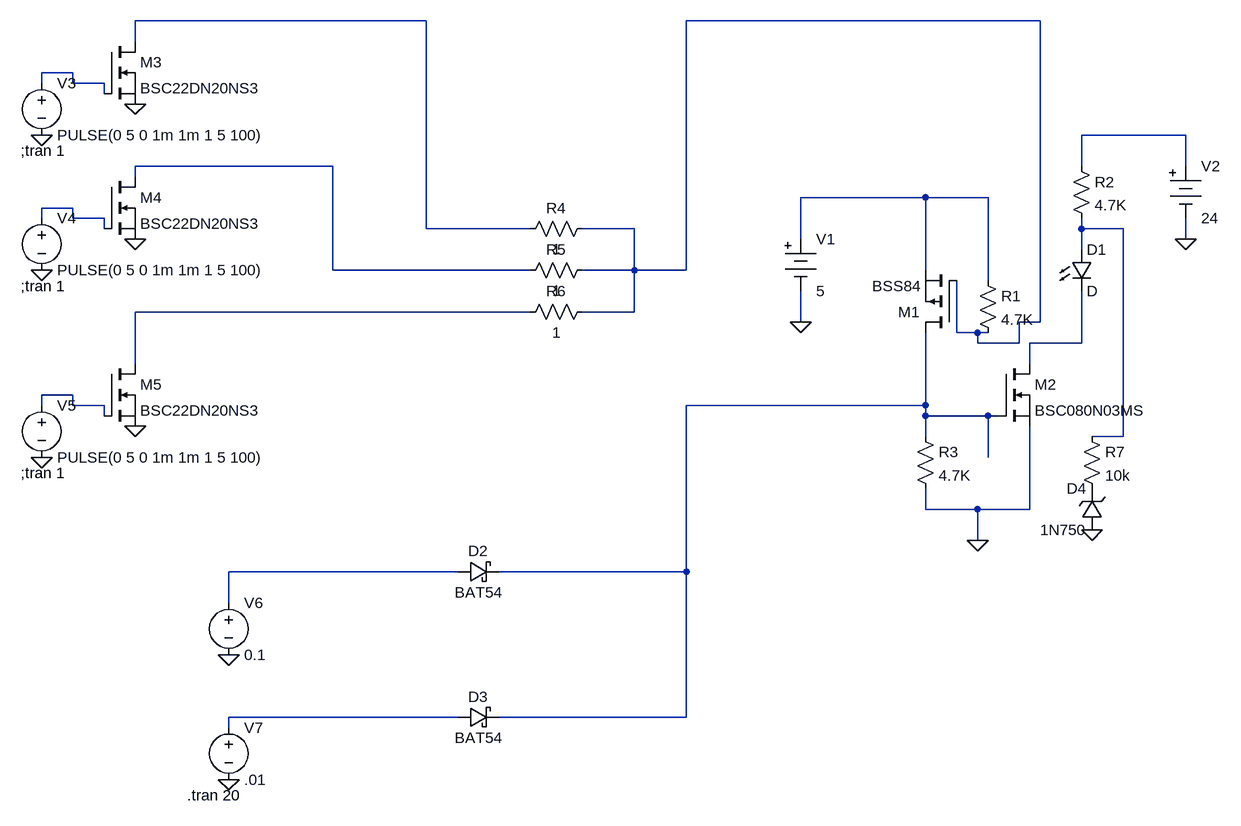
[diagram p0: schematic PCC FAULT LED.asc]
PCC FAULT LED.asc, the LTspice schematic file:
Version 4
SHEET 1 880 888
WIRE -560 -320 -1008 -320
WIRE 384 -320 -160 -320
WIRE -1008 -288 -1008 -320
WIRE -1104 -240 -1152 -240
WIRE -1152 -224 -1152 -240
WIRE -1104 -224 -1104 -240
WIRE -1056 -224 -1104 -224
WIRE -1056 -208 -1056 -224
WIRE 608 -144 448 -144
WIRE -704 -96 -1008 -96
WIRE 448 -96 448 -144
WIRE 608 -96 608 -144
WIRE -1008 -80 -1008 -96
WIRE 208 -48 16 -48
WIRE 304 -48 208 -48
WIRE -1104 -32 -1152 -32
WIRE -1152 -16 -1152 -32
WIRE -1104 -16 -1104 -32
WIRE -1056 -16 -1104 -16
WIRE -1056 0 -1056 -16
WIRE -560 0 -560 -320
WIRE -400 0 -560 0
WIRE -240 0 -320 0
WIRE 448 0 448 -16
WIRE 512 0 448 0
WIRE 16 16 16 -48
WIRE 608 16 608 -16
WIRE 448 32 448 0
WIRE -704 64 -704 -96
WIRE -400 64 -704 64
WIRE -240 64 -240 0
WIRE -240 64 -320 64
WIRE -160 64 -160 -320
WIRE -160 64 -240 64
WIRE 208 64 208 -48
WIRE 304 80 304 -48
WIRE -400 128 -1008 128
WIRE -240 128 -240 64
WIRE -240 128 -320 128
WIRE 16 144 16 96
WIRE 384 144 384 -320
WIRE 384 144 352 144
WIRE 256 160 256 80
WIRE 288 160 256 160
WIRE 304 160 288 160
WIRE 288 176 288 160
WIRE 352 176 352 144
WIRE 352 176 288 176
WIRE 448 176 448 96
WIRE 448 176 368 176
WIRE -1008 208 -1008 128
WIRE 368 208 368 176
WIRE -1104 256 -1152 256
WIRE -1152 272 -1152 256
WIRE -1104 272 -1104 256
WIRE -1056 272 -1104 272
WIRE 208 272 208 160
WIRE 208 272 -160 272
WIRE -1056 288 -1056 272
WIRE 208 288 208 272
WIRE 304 288 208 288
WIRE 320 288 304 288
WIRE 208 320 208 288
WIRE 512 320 512 0
WIRE 512 320 464 320
WIRE 304 352 304 288
WIRE 208 432 208 400
WIRE 288 432 208 432
WIRE 368 432 368 304
WIRE 368 432 288 432
WIRE 288 480 288 432
WIRE -512 528 -864 528
WIRE -160 528 -160 272
WIRE -160 528 -448 528
WIRE -864 576 -864 528
WIRE -512 752 -864 752
WIRE -160 752 -160 528
WIRE -160 752 -448 752
WIRE -864 768 -864 752
FLAG 16 144 0
FLAG 608 16 0
FLAG 288 480 0
FLAG -864 848 0
FLAG -864 656 0
FLAG -1152 -144 0
FLAG -1008 -192 0
FLAG -1152 64 0
FLAG -1008 16 0
FLAG -1152 352 0
FLAG -1008 304 0
FLAG 464 464 0
SYMBOL pmos 256 160 R180
SYMATTR InstName M1
SYMATTR Value BSS84
SYMBOL nmos 320 208 R0
SYMATTR InstName M2
SYMATTR Value BSC080N03MS
SYMBOL res 288 64 R0
SYMATTR InstName R1
SYMATTR Value 4.7K
SYMBOL Misc\\battery 16 0 R0
WINDOW 123 0 0 Left 2
WINDOW 39 0 0 Left 2
SYMATTR InstName V1
SYMATTR Value 5
SYMBOL LED 432 32 R0
SYMATTR InstName D1
SYMBOL res 432 -112 R0
SYMATTR InstName R2
SYMATTR Value 4.7K
SYMBOL Misc\\battery 608 -112 R0
WINDOW 123 0 0 Left 2
WINDOW 39 0 0 Left 2
SYMATTR InstName V2
SYMATTR Value 24
SYMBOL res 192 304 R0
SYMATTR InstName R3
SYMATTR Value 4.7K
SYMBOL res -304 -16 R90
WINDOW 0 0 56 VBottom 2
WINDOW 3 32 56 VTop 2
SYMATTR InstName R4
SYMATTR Value 1
SYMBOL res -304 48 R90
WINDOW 0 0 56 VBottom 2
WINDOW 3 32 56 VTop 2
SYMATTR InstName R5
SYMATTR Value 1
SYMBOL res -304 112 R90
WINDOW 0 0 56 VBottom 2
WINDOW 3 32 56 VTop 2
SYMATTR InstName R6
SYMATTR Value 1
SYMBOL voltage -864 560 R0
WINDOW 123 0 0 Left 2
WINDOW 39 0 0 Left 2
SYMATTR InstName V6
SYMATTR Value 0.1
SYMBOL voltage -864 752 R0
WINDOW 123 0 0 Left 2
WINDOW 39 0 0 Left 2
SYMATTR InstName V7
SYMATTR Value .01
SYMBOL schottky -512 544 R270
WINDOW 0 32 32 VTop 2
WINDOW 3 0 32 VBottom 2
SYMATTR InstName D2
SYMATTR Value BAT54
SYMATTR Description Diode
SYMATTR Type diode
SYMBOL schottky -512 768 R270
WINDOW 0 32 32 VTop 2
WINDOW 3 0 32 VBottom 2
SYMATTR InstName D3
SYMATTR Value BAT54
SYMATTR Description Diode
SYMATTR Type diode
SYMBOL voltage -1152 -240 R0
WINDOW 123 0 0 Left 2
WINDOW 39 0 0 Left 2
SYMATTR InstName V3
SYMATTR Value PULSE(0 5 0 1m 1m 1 5 100)
SYMBOL nmos -1056 -288 R0
SYMATTR InstName M3
SYMATTR Value BSC22DN20NS3
SYMBOL voltage -1152 -32 R0
WINDOW 123 0 0 Left 2
WINDOW 39 0 0 Left 2
SYMATTR InstName V4
SYMATTR Value PULSE(0 5 0 1m 1m 1 5 100)
SYMBOL nmos -1056 -80 R0
SYMATTR InstName M4
SYMATTR Value BSC22DN20NS3
SYMBOL voltage -1152 256 R0
WINDOW 123 0 0 Left 2
WINDOW 39 0 0 Left 2
SYMATTR InstName V5
SYMATTR Value PULSE(0 5 0 1m 1m 1 5 100)
SYMBOL nmos -1056 208 R0
SYMATTR InstName M5
SYMATTR Value BSC22DN20NS3
SYMBOL zener 480 464 R180
WINDOW 0 24 64 Left 2
WINDOW 3 24 0 Left 2
SYMATTR InstName D4
SYMATTR Value 1N750
SYMBOL res 448 304 R0
SYMATTR InstName R7
SYMATTR Value 10k
TEXT -928 872 Left 2 !.tran 20
TEXT -1184 -120 Left 2 !;tran 1
TEXT -1184 88 Left 2 !;tran 1
TEXT -1184 376 Left 2 !;tran 1

The netlist it stands for:
* PCC FAULT LED.asc
M1 N012 N002 N006 N006 BSS84
M2 N010 N012 0 0 BSC080N03MS
R1 N006 N002 4.7K
V1 N006 0 5
D1 N008 N010 D
R2 N004 N008 4.7K
V2 N004 0 24
R3 N012 0 4.7K
R4 N002 N001 1
R5 N002 N005 1
R6 N002 N009 1
V6 N013 0 0.1
V7 N014 0 .01
D2 N013 N012 BAT54
D3 N014 N012 BAT54
V3 N003 0 PULSE(0 5 0 1m 1m 1 5 100)
M3 N001 N003 0 0 BSC22DN20NS3
V4 N007 0 PULSE(0 5 0 1m 1m 1 5 100)
M4 N005 N007 0 0 BSC22DN20NS3
V5 N011 0 PULSE(0 5 0 1m 1m 1 5 100)
M5 N009 N011 0 0 BSC22DN20NS3
D4 0 P001 1N750
R7 N008 P001 10k
.model D D
.lib standard.dio
.model NMOS NMOS
.model PMOS PMOS
.lib standard.mos
.tran 20
;tran 1
;tran 1
;tran 1
.backanno
.end